# Altium schematic sheet [03] - SCHEMATIC.SchDoc (part 2 of 3)
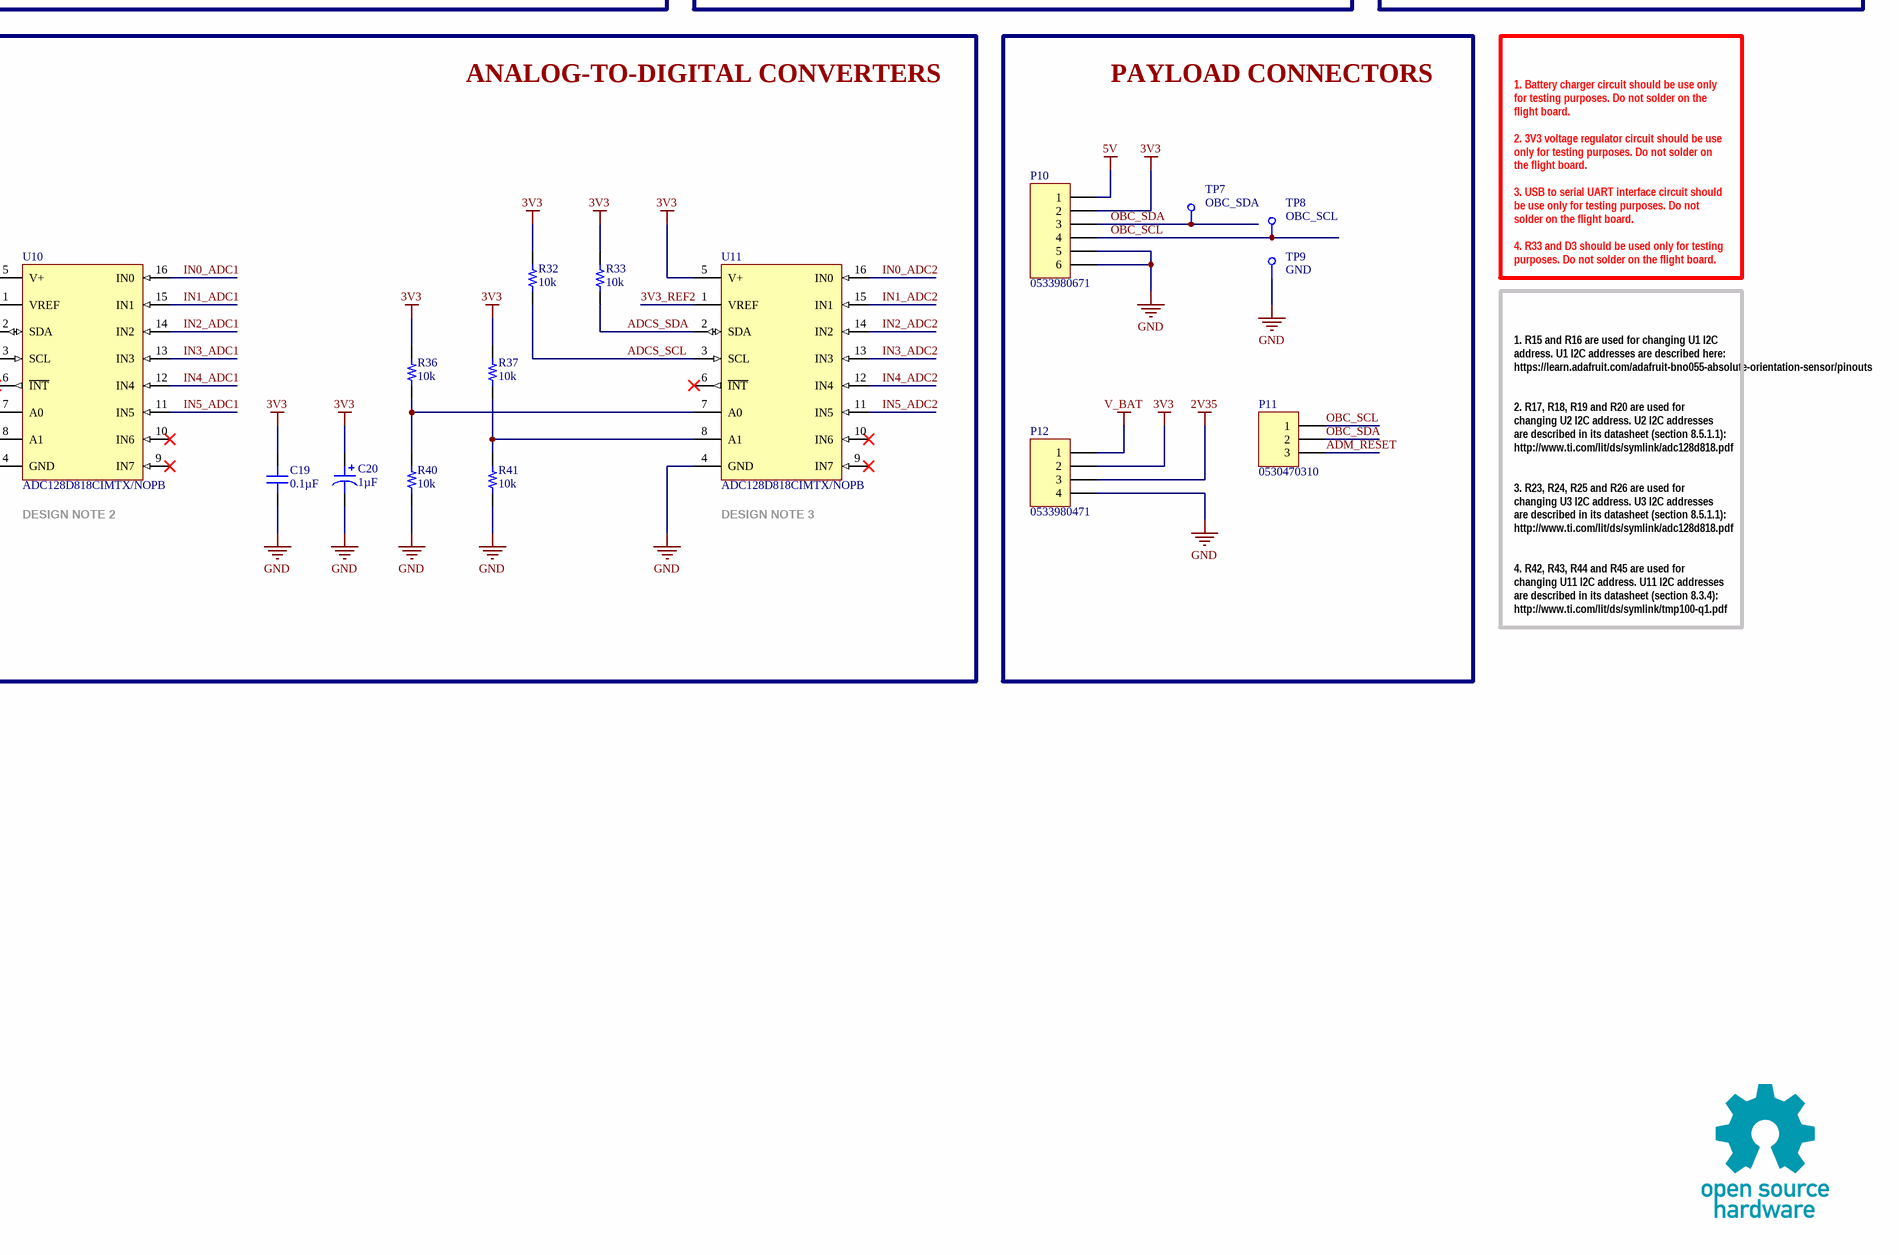
[diagram p4: [03] - SCHEMATIC.SchDoc, bottom right]
## Library data of the parts
C1 C4 = CC0805KKX7R7BB105: CAP CER 1UF 16V X7R 0805; Manufacturer: Yageo; Catalog Drawings: CC_0805_1.25; Featured Product: Yageo - High Capacitance MLCC; Tolerance: ±10%; Online Catalog: CC Series; Other Names: 311-1365-6; Supplier 1: Digi-Key; Manufacturer Part Number: CC0805KKX7R7BB105; Stock 1: 1004673; Pricing 1: 1=0.11, 10=0.079, 100=0.0352, 500=0.0252, 1000=0.0198 (USD); Standard Package: 1; Category: Capacitors; Family: Ceramic Capacitors; Series: CC; Packaging: Digi-Reel®; Voltage - Rated: 16V; Temperature Coefficient: X7R; Mounting Type: Surface Mount, MLCC; Operating Temperature: -55°C ~ 125°C; Applications: General Purpose; Ratings: -; Package / Case: 0805 (2012 Metric); Size / Dimension: 0.079" L x 0.049" W (2.00mm x 1.25mm); Height - Seated (Max): -; Thickness (Max): 0.049" (1.25mm); Lead Spacing: -; Features: -; Lead Style: -; ComponentLink1URL: https://datasheet.ciiva.com/144/mlccorderingcode-144902.pdf; ComponentLink1Description: https://datasheet.ciiva.com/144/mlccorderingcode-144902.pdf; ComponentLink2URL: https://datasheet.ciiva.com/13173/upy-gp-np0-16v-to-50v-8-3714-13173254.pdf; ComponentLink2Description: https://datasheet.ciiva.com/13173/upy-gp-np0-16v-to-50v-8-3714-13173254.pdf; ComponentLink3URL: https://datasheet.ciiva.com/15189/getdatasheetpartid-251802-15189206.pdf; ComponentLink3Description: https://datasheet.ciiva.com/15189/getdatasheetpartid-251802-15189206.pdf; ComponentLink4URL: https://datasheet.ciiva.com/144/mlccorderingcode-144903.pdf; ComponentLink4Description: https://datasheet.ciiva.com/144/mlccorderingcode-144903.pdf; ComponentLink5URL: https://datasheet.ciiva.com/144/mlccorderingcode-144904.pdf; ComponentLink5Description: https://datasheet.ciiva.com/144/mlccorderingcode-144904.pdf; ComponentLink6URL: https://datasheet.ciiva.com/7978/1489800-7978201.pdf; ComponentLink6Description: https://datasheet.ciiva.com/7978/1489800-7978201.pdf; ComponentLink7URL: https://datasheet.ciiva.com/28450/1489800-28450750.pdf; ComponentLink7Description: https://datasheet.ciiva.com/28450/1489800-28450750.pdf; ComponentLink8URL: https://datasheet.ciiva.com/11464/upy-gphc-x7r-6-3v-to-50v-8-11464750.pdf; ComponentLink8Description: https://datasheet.ciiva.com/11464/upy-gphc-x7r-6-3v-to-50v-8-11464750.pdf; Supplier Part Number 1: 311-1365-1-ND
C2 C3 C5 C10 = LMK212BJ106KG-T: CAP CER 10UF 10V X5R 0805; Manufacturer: Taiyo Yuden; PCN Part Number: X5R, X7R Dielectrics 23/Jan/2008; Catalog Drawings: xMK Series_0805_1.25; Featured Product: Multilayer Chip Capacitors; Tolerance: ±10%; Online Catalog: M Series; Kits: 587-1797-KIT-ND  - KIT CAP CER HI CAP 0603 & 0805 S; Other Names: 587-1300-1; Supplier 1: Digi-Key; Manufacturer Part Number: LMK212BJ106KG-T; Stock 1: 858762; Pricing 1: 1=0.14, 10=0.1, 100=0.0468, 500=0.0328, 1000=0.0272 (USD); Standard Package: 1; Category: Capacitors; Family: Ceramic Capacitors; Series: M; Packaging: Cut Tape (CT); Voltage - Rated: 10V; Temperature Coefficient: X5R; Mounting Type: Surface Mount, MLCC; Operating Temperature: -55°C ~ 85°C; Applications: General Purpose; Ratings: -; Package / Case: 0805 (2012 Metric); Size / Dimension: 0.079" L x 0.049" W (2.00mm x 1.25mm); Height - Seated (Max): -; Thickness (Max): 0.053" (1.35mm); Lead Spacing: -; Features: -; Lead Style: -; ComponentLink1URL: https://datasheet.ciiva.com/26872/getdatasheetpartid-638410-26872692.pdf; ComponentLink1Description: https://datasheet.ciiva.com/26872/getdatasheetpartid-638410-26872692.pdf; ComponentLink2URL: https://datasheet.ciiva.com/7975/1497285-7975797.pdf; ComponentLink2Description: https://datasheet.ciiva.com/7975/1497285-7975797.pdf; ComponentLink3URL: https://datasheet.ciiva.com/7975/1497285-7975799.pdf; ComponentLink3Description: https://datasheet.ciiva.com/7975/1497285-7975799.pdf; ComponentLink4URL: https://datasheet.ciiva.com/135/mlcc-all-e-135133.pdf; ComponentLink4Description: https://datasheet.ciiva.com/135/mlcc-all-e-135133.pdf; ComponentLink5URL: https://datasheet.ciiva.com/135/mlcc-all-e-135134.pdf; ComponentLink5Description: https://datasheet.ciiva.com/135/mlcc-all-e-135134.pdf; ComponentLink6URL: https://datasheet.ciiva.com/30259/719lmk212abj106kg-t-30259022.pdf; ComponentLink6Description: https://datasheet.ciiva.com/30259/719lmk212abj106kg-t-30259022.pdf; ComponentLink7URL: https://datasheet.ciiva.com/135/mlcc-all-e-135135.pdf; ComponentLink7Description: https://datasheet.ciiva.com/135/mlcc-all-e-135135.pdf; Supplier Part Number 1: 587-1300-1-ND
C6-C8 = C2012X7R1H104K085AA: CAP CER 0.1UF 50V X7R 0805; Manufacturer: TDK; PCN Part Number: MLCC Part Number Change 30/Nov/2012; Product Training Modules: C Series General Applications SEAT, CCV, and TVCL Design Tools Guide to Replacing an Electrolytic Capacitor with an MLCC; Tolerance: ±10%; Online Catalog: C Series, General Purpose; Kits: 445-9015-KIT-ND  - KIT MLCC 1000PF-47UF 0805 10-50V; Other Names: 445-7534-1; Supplier 1: Digi-Key; Manufacturer Part Number: C2012X7R1H104K085AA; Stock 1: 6397; Pricing 1: 1=0.12, 10=0.086, 100=0.0403, 500=0.0282, 1000=0.0234 (USD); RoHS Information: RoHS Certificate-MLCC; Standard Package: 1; Category: Capacitors; Family: Ceramic Capacitors; Series: C; Packaging: Cut Tape (CT); Voltage - Rated: 50V; Temperature Coefficient: X7R; Mounting Type: Surface Mount, MLCC; Operating Temperature: -55°C ~ 125°C; Applications: General Purpose; Ratings: -; Package / Case: 0805 (2012 Metric); Size / Dimension: 0.079" L x 0.049" W (2.00mm x 1.25mm); Height - Seated (Max): -; Thickness (Max): 0.037" (0.95mm); Lead Spacing: -; Features: -; Lead Style: -; ComponentLink1URL: https://datasheet.ciiva.com/11788/0900766b80c1bb00-11788128.pdf; ComponentLink1Description: https://datasheet.ciiva.com/11788/0900766b80c1bb00-11788128.pdf; ComponentLink2URL: https://datasheet.ciiva.com/6250/tdkmlcccaprange-6250821.pdf; ComponentLink2Description: https://datasheet.ciiva.com/6250/tdkmlcccaprange-6250821.pdf; ComponentLink3URL: https://datasheet.ciiva.com/24217/c2012x7r1h104k085aa-264864-24217862.pdf; ComponentLink3Description: https://datasheet.ciiva.com/24217/c2012x7r1h104k085aa-264864-24217862.pdf; ComponentLink4URL: https://datasheet.ciiva.com/24191/e412-c-24191447.pdf; ComponentLink4Description: https://datasheet.ciiva.com/24191/e412-c-24191447.pdf; ComponentLink5URL: https://datasheet.ciiva.com/6250/tdkmlcccaprange-6250824.pdf; ComponentLink5Description: https://datasheet.ciiva.com/6250/tdkmlcccaprange-6250824.pdf; ComponentLink6URL: https://datasheet.ciiva.com/23803/1796654-23803035.pdf; ComponentLink6Description: https://datasheet.ciiva.com/23803/1796654-23803035.pdf; ComponentLink7URL: https://datasheet.ciiva.com/28602/1571323-28602204.pdf; ComponentLink7Description: https://datasheet.ciiva.com/28602/1571323-28602204.pdf; Supplier Part Number 1: 445-7534-1-ND
C9 C14 C16 C17 C19 = C0805C104Z3VACTU: Multilayer Ceramic Capacitors MLCC - SMD/SMT 25volts 0.1uF Y5V -20+80%; Manufacturer: KEMET; Part # Aliases: C0805C104Z3VAC7800; Capacitance - nF: 100 nF; Capacitance - pF: 100000 pF; Voltage Rating: 25 V; Tolerance: - 20 %, + 80 %; Case Height: 0.9 mm; Case Length: 2 mm; Case Width: 1.2 mm; Class: 3; Dissipation Factor DF: 7; Temperature Coefficient / Code: - 82 %, + 22 %; Type: Y5V Dielectric, Commercial; Supplier 1: Digi-Key; Manufacturer Part Number: C0805C104Z3VACTU; Stock 1: 70310; Pricing 1: 1=0.1, 10=0.065, 100=0.0289, 500=0.0207, 1000=0.0162 (USD); Dimensions: 1.2 mm W x 2 mm L x 0.9 mm H; Product Category: Multilayer Ceramic Capacitors MLCC - SMD/SMT; RoHS: Details; Brand: Kemet; Voltage Rating DC: 25 V; Dielectric: Y5V; Case Code - in: 0805; Case Code - mm: 2012; Minimum Operating Temperature: - 30 C; Maximum Operating Temperature: + 85 C; Product: General Type MLCCs; Lead Spacing: 0.75 mm; Operating Temperature Range: - 30 C to + 85 C; Package / Case: 0805 (2012 metric); Packaging: Reel; Series: C0805C; Factory Pack Quantity: 4000; Termination Style: SMD/SMT; ComponentLink1URL: http://www.farnell.com/datasheets/2112180.pdf; ComponentLink1Description: http://www.farnell.com/datasheets/2112180.pdf; ComponentLink2URL: http://www.mouser.com/ds/2/212/KEM_C1005_Y5V_SMD-1101305.pdf; ComponentLink2Description: http://www.mouser.com/ds/2/212/KEM_C1005_Y5V_SMD-1101305.pdf; ComponentLink3URL: https://search.kemet.com/component-edge/download/datasheet/C0805C104Z3VACTU.pdf; ComponentLink3Description: https://search.kemet.com/component-edge/download/datasheet/C0805C104Z3VACTU.pdf; ComponentLink4URL: http://capacitoredge.kemet.com/capedge2/DataSheet?pn=C0805C104Z3VACTU; ComponentLink4Description: http://capacitoredge.kemet.com/capedge2/DataSheet?pn=C0805C104Z3VACTU; ComponentLink5URL: http://components.arrow.com/part/dataview/2091117S3443012N7429; ComponentLink5Description: http://components.arrow.com/part/dataview/2091117S3443012N7429; Supplier Part Number 1: 399-9158-1-ND
C11 C12 = GCM155R71H223KA55D: CAP CER 0.022UF 50V X7R 0402; Manufacturer: Murata; Tolerance (%): ±10 %; Supplier 1: Digi-Key; Manufacturer Part Number: GCM155R71H223KA55D; Stock 1: 1313391; Pricing 1: 1=0.1, 10=0.042, 100=0.0186, 500=0.0133, 1000=0.0104, 2500=0.0095, 5000=0.0087 (USD); Dielectric: X7R; Rated Voltage: 50 V; Case Size: 0402 (1005 Metric); ComponentLink1URL: https://datasheet.ciiva.com/155/product-155890.pdf; ComponentLink1Description: https://datasheet.ciiva.com/155/product-155890.pdf; ComponentLink2URL: https://datasheet.ciiva.com/155/product-155891.pdf; ComponentLink2Description: https://datasheet.ciiva.com/155/product-155891.pdf; ComponentLink3URL: https://datasheet.ciiva.com/155/product-155892.pdf; ComponentLink3Description: https://datasheet.ciiva.com/155/product-155892.pdf; ComponentLink4URL: https://datasheet.ciiva.com/16199/product-16199333.pdf; ComponentLink4Description: https://datasheet.ciiva.com/16199/product-16199333.pdf; ComponentLink5URL: https://datasheet.ciiva.com/16624/product-16624552.pdf; ComponentLink5Description: https://datasheet.ciiva.com/16624/product-16624552.pdf; Supplier Part Number 1: 490-4763-1-ND
C13 C15 = C0805C180J5GAC-TU: CAP CER 18PF 50V NP0 0805; Manufacturer: KEMET; Case Style: Ceramic Chip; Product Depth (mm): 1.25 mm; Product Diameter (mm): Not Required mm; Product Height (mm): 0.78 mm; Product Length (mm): 2 mm; Rad Hardened: No; Temp Coeff (Dielectric): C0G; Tolerance (+ or -): 5%; Voltage: 50VDC; Wire Form: Not Required; Supplier 1: Digi-Key; Manufacturer Part Number: C0805C180J5GAC-TU; Stock 1: 86172; Pricing 1: 1=0.11, 10=0.08, 100=0.0374, 500=0.0262, 1000=0.0217 (USD); Construction: SMT Chip; Failure Rate: Not Required; Mounting Style: Surface Mount; Operating Temp Range: -55C to 125C; Package / Case: 0805; Packaging: Tape and Reel; ComponentLink1URL: https://datasheet.ciiva.com/6136/1725432-6136736.pdf; ComponentLink1Description: https://datasheet.ciiva.com/6136/1725432-6136736.pdf; ComponentLink2URL: https://datasheet.ciiva.com/144/docfinderpartnumber-c0805c180j5gactu-144929.pdf; ComponentLink2Description: https://datasheet.ciiva.com/144/docfinderpartnumber-c0805c180j5gactu-144929.pdf; ComponentLink3URL: https://datasheet.ciiva.com/22746/1769375-22746770.pdf; ComponentLink3Description: https://datasheet.ciiva.com/22746/1769375-22746770.pdf; ComponentLink4URL: https://datasheet.ciiva.com/28696/1789732-28696024.pdf; ComponentLink4Description: https://datasheet.ciiva.com/28696/1789732-28696024.pdf; ComponentLink5URL: https://datasheet.ciiva.com/7842/1725432-7842235.pdf; ComponentLink5Description: https://datasheet.ciiva.com/7842/1725432-7842235.pdf; ComponentLink6URL: https://datasheet.ciiva.com/11463/kem-c1003-c0g-smd-11463499.pdf; ComponentLink6Description: https://datasheet.ciiva.com/11463/kem-c1003-c0g-smd-11463499.pdf; ComponentLink7URL: https://datasheet.ciiva.com/7842/1725432-7842236.pdf; ComponentLink7Description: https://datasheet.ciiva.com/7842/1725432-7842236.pdf; ComponentLink8URL: https://datasheet.ciiva.com/26923/getdatasheetpartid-759702-26923980.pdf; ComponentLink8Description: https://datasheet.ciiva.com/26923/getdatasheetpartid-759702-26923980.pdf; ComponentLink9URL: https://datasheet.ciiva.com/5419/kem-c1003-c0g-smd-356956-5419246.pdf; ComponentLink9Description: https://datasheet.ciiva.com/5419/kem-c1003-c0g-smd-356956-5419246.pdf; Supplier Part Number 1: 399-1112-1-ND
C18 C20 = F921C105MPA: CAP TANT 1UF 16V 20% 0805; Manufacturer: Kyocera AVX; Supplier 1: Digi-Key; Manufacturer Part Number: F921C105MPA; Stock 1: 35413; Pricing 1: 1=0.39, 10=0.274, 100=0.1641, 500=0.1231, 1000=0.1039 (USD); ComponentLink1URL: http://www.mouser.com/ds/2/40/f92-776551.pdf; ComponentLink1Description: http://www.mouser.com/ds/2/40/f92-776551.pdf; ComponentLink2URL: http://datasheets.avx.com/f92.pdf; ComponentLink2Description: http://datasheets.avx.com/f92.pdf; Supplier Part Number 1: 478-8126-6-ND
D1 D3 D5 = APT1608SYCK: LED 1.6X0.8MM 590NM YLW CLR SMD; Manufacturer: Kingbright; Catalog Drawings: APT1608 Series Top / APT1608 Series Side; 3D Model: APT1608x.sldprt / APT1608x.pro / APT1608x.igs / APT1608x.stp; Color: Yellow; Millicandela Rating: 150mcd; Voltage - Forward (Vf) (Typ): 2V; Current - Test: 20mA; Viewing Angle: 120°; Lens Type: Clear; Lens Style/Size: Rectangle with Flat Top, 1.2mm x 0.8mm; Online Catalog: 0603 Rectangle with Flat Top Chip LEDs; Other Names: 754-1124-2; Supplier 1: Digi-Key; Manufacturer Part Number: APT1608SYCK; Stock 1: 241560; Pricing 1: 1=0.43, 10=0.307, 25=0.2352, 100=0.1535, 250=0.1125, 500=0.0955, 1000=0.0784 (USD); Standard Package: 2,000; Category: Optoelectronics; Family: LED Indication - Discrete; Packaging: Tape & Reel (TR); Wavelength - Dominant: 590nm; Wavelength - Peak: 590nm; Package / Case: 0603 (1608 Metric); Size / Dimension: 1.60mm L x 0.80mm W; Height: 0.75mm; Mounting Type: Surface Mount; ComponentLink1URL: https://datasheet.ciiva.com/2113/apt1608syck-2113824.pdf; ComponentLink1Description: https://datasheet.ciiva.com/2113/apt1608syck-2113824.pdf; ComponentLink2URL: https://datasheet.ciiva.com/2113/apt1608syck-2113825.pdf; ComponentLink2Description: https://datasheet.ciiva.com/2113/apt1608syck-2113825.pdf; ComponentLink3URL: https://datasheet.ciiva.com/2113/apt1608syck-2113826.pdf; ComponentLink3Description: https://datasheet.ciiva.com/2113/apt1608syck-2113826.pdf; ComponentLink4URL: https://datasheet.ciiva.com/4688/apt1608syck-35136-4688900.pdf; ComponentLink4Description: https://datasheet.ciiva.com/4688/apt1608syck-35136-4688900.pdf; ComponentLink5URL: https://datasheet.ciiva.com/14603/70062842-14603786.pdf; ComponentLink5Description: https://datasheet.ciiva.com/14603/70062842-14603786.pdf; Supplier Part Number 1: 754-1124-1-ND
D2 = MBR120VLSFT3G: Schottky Diodes & Rectifiers 1A 20V; Manufacturer: ON Semiconductor; PCN Design/Specification: SOD123-FL Package Height 13/Sep/2013; Voltage - Forward (Vf) (Max) @ If: 340mV @ 1A; Speed: Fast Recovery =  200mA (Io); Current - Reverse Leakage @ Vr: 600µA @ 20V; Other Names: MBR120VLSFT3GOSDKR; Supplier 1: Digi-Key; Manufacturer Part Number: MBR120VLSFT3G; Stock 1: 5944; Pricing 1: 1=0.42, 10=0.338, 100=0.2298, 500=0.1723, 1000=0.1293 (USD); Standard Package: 1; Category: Discrete Semiconductor Products; Family: Diodes, Rectifiers - Single; Series: -; Packaging: Digi-Reel®; Diode Type: Schottky; Voltage - DC Reverse (Vr) (Max): 20V; Current - Average Rectified (Io): 1A; Reverse Recovery Time (trr): -; Capacitance @ Vr, F: -; Mounting Type: Surface Mount; Package / Case: SOD-123F; Supplier Device Package: SOD-123FL; Operating Temperature - Junction: -65°C ~ 125°C; Online Catalog: Schottky Diode; ComponentLink1URL: https://datasheet.ciiva.com/4715/mbr120vlsft1-d-107081-4715104.pdf; ComponentLink1Description: https://datasheet.ciiva.com/4715/mbr120vlsft1-d-107081-4715104.pdf; ComponentLink2URL: https://datasheet.ciiva.com/6380/mbr120vlsft1-d-6380907.pdf; ComponentLink2Description: https://datasheet.ciiva.com/6380/mbr120vlsft1-d-6380907.pdf; ComponentLink3URL: https://datasheet.ciiva.com/8294/mbr120vlsft1-d-8294603.pdf; ComponentLink3Description: https://datasheet.ciiva.com/8294/mbr120vlsft1-d-8294603.pdf; ComponentLink4URL: https://datasheet.ciiva.com/6380/mbr120vlsft1-d-6380910.pdf; ComponentLink4Description: https://datasheet.ciiva.com/6380/mbr120vlsft1-d-6380910.pdf; Supplier Part Number 1: MBR120VLSFT3GOSCT-ND
D4 = APT1608SGC: LED 1.6X0.8MM 568NM GRN CLR SMD; Manufacturer: Kingbright; Catalog Drawings: APT1608 Series Top / APT1608 Series Side; 3D Model: APT1608x.sldprt / APT1608x.pro / APT1608x.igs / APT1608x.stp; Color: Green; Wavelength - Peak: 565nm; Millicandela Rating: 15mcd; Voltage - Forward (Vf) (Typ): 2.2V; Current - Test: 20mA; Viewing Angle: 120°; Lens Type: Clear; Lens Style/Size: Rectangle with Flat Top, 1.2mm x 0.8mm; Online Catalog: 0603 Rectangle with Flat Top Chip LEDs; Other Names: 754-1121-2; Supplier 1: Digi-Key; Manufacturer Part Number: APT1608SGC; Stock 1: 466268; Pricing 1: 1=0.39, 10=0.282, 25=0.208, 100=0.1485, 250=0.101, 500=0.0891, 1000=0.0698 (USD); Standard Package: 2,000; Category: Optoelectronics; Family: LED Indication - Discrete; Packaging: Tape & Reel (TR); Wavelength - Dominant: 568nm; Package / Case: 0603 (1608 Metric); Size / Dimension: 1.60mm L x 0.80mm W; Height: 0.75mm; Mounting Type: Surface Mount; ComponentLink1URL: https://datasheet.ciiva.com/2113/apt1608sgc-2113808.pdf; ComponentLink1Description: https://datasheet.ciiva.com/2113/apt1608sgc-2113808.pdf; ComponentLink2URL: https://datasheet.ciiva.com/12400/apt1608sgc-32861-12400932.pdf; ComponentLink2Description: https://datasheet.ciiva.com/12400/apt1608sgc-32861-12400932.pdf; ComponentLink3URL: https://datasheet.ciiva.com/14603/70062839-14603927.pdf; ComponentLink3Description: https://datasheet.ciiva.com/14603/70062839-14603927.pdf; Supplier Part Number 1: 754-1121-1-ND; Supplier 2: Digi-Key; Supplier Part Number 2: 311-10.0MCRCT-ND
MH1-MH4 = MH_3.8MMNC_2MMD: Mounting Hole 3.8mm Diameter (Non Copper), 2.5mm Drill NPTH
P1 = S2B-PH-SM4-TB(LF)(SN): 2 Positions Header, Shrouded Connector 0.079" (2.00mm) Surface Mount, Right Angle Tin; Manufacturer: JST; No of Positions: 2; Pitch: 2 mm; Style/Orientation: Right Angle Header/Plug; Supplier 1: Digi-Key; Manufacturer Part Number: S2B-PH-SM4-TB(LF)(SN); Stock 1: 113530; Pricing 1: 1=0.58, 10=0.547, 100=0.4194, 500=0.3647 (USD); Type: Shrouded Header; Termination: Crimp; ComponentLink1URL: https://datasheet.ciiva.com/11747/0900766b80df0d9d-11747104.pdf; ComponentLink1Description: https://datasheet.ciiva.com/11747/0900766b80df0d9d-11747104.pdf; ComponentLink2URL: https://datasheet.ciiva.com/712/eph-712514.pdf; ComponentLink2Description: https://datasheet.ciiva.com/712/eph-712514.pdf; ComponentLink3URL: https://datasheet.ciiva.com/712/eph-712515.pdf; ComponentLink3Description: https://datasheet.ciiva.com/712/eph-712515.pdf; ComponentLink4URL: https://datasheet.ciiva.com/712/eph-712516.pdf; ComponentLink4Description: https://datasheet.ciiva.com/712/eph-712516.pdf; ComponentLink5URL: https://datasheet.ciiva.com/16199/s2b-ph-sm4-tblfsn-16199686.pdf; ComponentLink5Description: https://datasheet.ciiva.com/16199/s2b-ph-sm4-tblfsn-16199686.pdf; ComponentLink6URL: https://datasheet.ciiva.com/26894/getdatasheetpartid-406256-26894907.pdf; ComponentLink6Description: https://datasheet.ciiva.com/26894/getdatasheetpartid-406256-26894907.pdf; Supplier Part Number 1: 455-1749-1-ND
P2 = 67997-106HLF: 6 Positions Header, Unshrouded Connector 0.100" (2.54mm) Through Hole Gold or Gold, GXT™; Manufacturer: Amphenol FCI; No. of Rows: 2; No. of Contacts: 6; Contact Termination: Through Hole Vertical; Supplier 1: Digi-Key; Manufacturer Part Number: 67997-106HLF; Stock 1: 896; Pricing 1: 1=1.73, 10=1.568, 100=1.3436, 500=1.1197, 1000=0.9597, 5000=0.8509, 10000=0.8317 (USD); Series: 67997; Pitch Spacing: 2.54mm; Gender: Header; Contact Plating: Gold; Contact Material: Phosphor Bronze; ComponentLink1URL: https://datasheet.ciiva.com/10149/67996-10149221.pdf; ComponentLink1Description: https://datasheet.ciiva.com/10149/67996-10149221.pdf; ComponentLink2URL: https://datasheet.ciiva.com/46393/1876884-46393067.pdf; ComponentLink2Description: https://datasheet.ciiva.com/46393/1876884-46393067.pdf; ComponentLink3URL: https://datasheet.ciiva.com/722/67996-722044.pdf; ComponentLink3Description: https://datasheet.ciiva.com/722/67996-722044.pdf; ComponentLink4URL: https://datasheet.ciiva.com/5153/67996-222463-5153820.pdf; ComponentLink4Description: https://datasheet.ciiva.com/5153/67996-222463-5153820.pdf; ComponentLink5URL: https://datasheet.ciiva.com/16726/67996-16726286.pdf; ComponentLink5Description: https://datasheet.ciiva.com/16726/67996-16726286.pdf; Supplier Part Number 1: 609-3393-ND
P3 = 10033526-N3212LF: Conn Mini USB Type B RCP 5 POS 0.8mm Solder RA SMD 5 Terminal 1 Port T/R; Manufacturer: Amphenol FCI; Brand: FCI; Number of Contacts: 5 Contact; Number of Ports: 1 Port; Gender: Female; Connector Type: Mini USB Type B Receptacle; Insulation Resistance: 100 MOhms; Mounting Angle: Right; Supplier 1: Digi-Key; Manufacturer Part Number: 10033526-N3212LF; Stock 1: 10314; Pricing 1: 1=0.71, 10=0.669, 25=0.602, 50=0.5352, 100=0.5128, 250=0.4682 (USD); Product Category: USB Connectors; RoHS: Details; Product: Mini USB Type B Connectors; Standard: USB; Termination Style: Solder Pad; Color: Black; Contact Material: Copper Alloy; Contact Plating: Gold; Flammability Rating: UL 94 V-0; Packaging: Reel; Shell Plating: Nickel; Factory Pack Quantity: 750; ComponentLink1URL: https://datasheet.ciiva.com/15181/getdatasheetpartid-168038-15181221.pdf; ComponentLink1Description: https://datasheet.ciiva.com/15181/getdatasheetpartid-168038-15181221.pdf; ComponentLink2URL: https://datasheet.ciiva.com/29660/10033526-29660229.pdf; ComponentLink2Description: https://datasheet.ciiva.com/29660/10033526-29660229.pdf; ComponentLink3URL: https://datasheet.ciiva.com/29660/10033526-29660230.pdf; ComponentLink3Description: https://datasheet.ciiva.com/29660/10033526-29660230.pdf; ComponentLink4URL: https://datasheet.ciiva.com/3094/10033526-3094696.pdf; ComponentLink4Description: https://datasheet.ciiva.com/3094/10033526-3094696.pdf; ComponentLink5URL: https://datasheet.ciiva.com/16668/10033526-16668584.pdf; ComponentLink5Description: https://datasheet.ciiva.com/16668/10033526-16668584.pdf; ComponentLink6URL: https://datasheet.ciiva.com/3094/10033526-3094413.pdf; ComponentLink6Description: https://datasheet.ciiva.com/3094/10033526-3094413.pdf; Supplier Part Number 1: 609-4700-1-ND
P4-P6 = 61300211121: Headers & Wire Housings WR-PHD 2.54mm Header 2P THT; Manufacturer: Wurth Electronics; Current Rating: 3A; Voltage Rating: 250V; Number of Positions: 2; Gender: Male; Connector Type: Male Pin; Pitch: 0.1inch; Supplier 1: Digi-Key; Manufacturer Part Number: 61300211121; Stock 1: 98753; Pricing 1: 1=0.13, 10=0.106, 25=0.088, 50=0.074, 100=0.067, 1000=0.061 (USD); Mount: Through Hole; Contact Plating: Gold; Housing Material: PBT; Contact Material: Copper,Copper Alloy; Colour: Black; Min Operating Temperature: -40°C; Max Operating Temperature: 125°C; Number of Rows: 1; Contact Gender: Male; Packaging: Bulk; Termination: Through Hole; Number of Contacts: 2; Contact Mating Length: 0.236inch; REACH SVHC: Unknown; Lead Free: Lead Free; ComponentLink1URL: https://datasheet.ciiva.com/13619/6130xx11121-48870-13619345.pdf; ComponentLink1Description: https://datasheet.ciiva.com/13619/6130xx11121-48870-13619345.pdf; Supplier Part Number 1: 732-5315-ND
P7-P9 P13 = 0532610371: 3 Positions Header, Shrouded Connector 0.049" (1.25mm) Surface Mount, Right Angle Tin; Manufacturer: Molex; Number of Positions: 3; Number of Positions Loaded: All; Supplier 1: Digi-Key; Manufacturer Part Number: 0532610371; Stock 1: 28698; Pricing 1: 1=1.13, 10=0.995, 100=0.8586, 500=0.7025 (USD); Category: Connectors, Interconnects; Family: Rectangular Connectors - Headers, Male Pins; Series: PicoBlade™ 53261; Packaging: Cut Tape (CT); Contact Type: Blade Pin; Connector Type: Header, Shrouded; Pitch: 0.049" (1.25mm); Number of Rows: 1; Row Spacing: -; Contact Mating Length: -; Mounting Type: Surface Mount, Right Angle; Termination: Solder; Fastening Type: -; Features: Solder Retention; Contact Finish: Tin; Contact Finish Thickness: 39µin (1.00µm); Color: Natural; ComponentLink1URL: https://datasheet.ciiva.com/392/532610371-sd-392113.pdf; ComponentLink1Description: https://datasheet.ciiva.com/392/532610371-sd-392113.pdf; ComponentLink2URL: https://datasheet.ciiva.com/392/532610371-sd-392114.pdf; ComponentLink2Description: https://datasheet.ciiva.com/392/532610371-sd-392114.pdf; ComponentLink3URL: https://datasheet.ciiva.com/392/532610371-sd-392115.pdf; ComponentLink3Description: https://datasheet.ciiva.com/392/532610371-sd-392115.pdf; ComponentLink4URL: https://datasheet.ciiva.com/3117/0532610371-pcb-headers-3117604.pdf; ComponentLink4Description: https://datasheet.ciiva.com/3117/0532610371-pcb-headers-3117604.pdf; ComponentLink5URL: https://datasheet.ciiva.com/3117/0532610371-pcb-headers-3117605.pdf; ComponentLink5Description: https://datasheet.ciiva.com/3117/0532610371-pcb-headers-3117605.pdf; ComponentLink6URL: https://datasheet.ciiva.com/3932/333250532610371-pcb-headers-3932824.pdf; ComponentLink6Description: https://datasheet.ciiva.com/3932/333250532610371-pcb-headers-3932824.pdf; ComponentLink7URL: https://datasheet.ciiva.com/48768/0532610371-pcb-headers-48768286.pdf; ComponentLink7Description: https://datasheet.ciiva.com/48768/0532610371-pcb-headers-48768286.pdf; Supplier Part Number 1: WM7621CT-ND
P10 = 0533980671: 6 Positions Header, Shrouded Connector 0.049" (1.25mm) Surface Mount, Right Angle Tin; Manufacturer: Molex; Manufacturer Part Number: 53398-0671; Voltage Rating: 125V; Current Rating: 1A; Number of Positions: 6; Gender: Male; Contact Resistance: 20mR; Insulation Resistance: 100MR; Glow Wire Compliant: Non-compliant; Supplier 1: Digi-Key; Stock 1: 40236; Pricing 1: 1=1.42, 10=1.249, 100=1.0776, 500=0.8817 (USD); Mount: Surface Mount; Colour: Natural; Housing Colour: Natural; Housing Material: Nylon; Contact Plating: Tin; Contact Material: Bronze,Tin; Body Plating: Tin; Min Operating Temperature: -40°C; Max Operating Temperature: 85°C; Packaging: Tape and Reel; Termination: Solder; Number of Rows: 1; Package Quantity: 1000; Orientation: Vertical; Number of Contacts: 6; Voltage Rating (AC): 125V; Working Voltage: 125V; Number of Circuits: 6; Voltage Rating (DC): 125V; Pitch: 1.25mm; Lead Pitch: 1.25mm; Radiation Hardening: No; REACH SVHC: Unknown; Lead Free: Lead Free; Flammability Rating: UL94 V-0; ComponentLink1URL: https://datasheet.ciiva.com/16658/0533980671-pcb-headers-16658433.pdf; ComponentLink1Description: https://datasheet.ciiva.com/16658/0533980671-pcb-headers-16658433.pdf; ComponentLink2URL: https://datasheet.ciiva.com/34303/1932643-34303345.pdf; ComponentLink2Description: https://datasheet.ciiva.com/34303/1932643-34303345.pdf; ComponentLink3URL: https://datasheet.ciiva.com/5153/0533980671-pcb-headers-256970-5153159.pdf; ComponentLink3Description: https://datasheet.ciiva.com/5153/0533980671-pcb-headers-256970-5153159.pdf; ComponentLink4URL: https://datasheet.ciiva.com/14156/gf116833-116846-e-14156247.pdf; ComponentLink4Description: https://datasheet.ciiva.com/14156/gf116833-116846-e-14156247.pdf; ComponentLink5URL: https://datasheet.ciiva.com/46393/1849224-46393479.pdf; ComponentLink5Description: https://datasheet.ciiva.com/46393/1849224-46393479.pdf; ComponentLink6URL: https://datasheet.ciiva.com/7917/1849224-7917050.pdf; ComponentLink6Description: https://datasheet.ciiva.com/7917/1849224-7917050.pdf; ComponentLink7URL: https://datasheet.ciiva.com/7917/1849224-7917051.pdf; ComponentLink7Description: https://datasheet.ciiva.com/7917/1849224-7917051.pdf; ComponentLink8URL: https://datasheet.ciiva.com/18454/70090674-18454268.pdf; ComponentLink8Description: https://datasheet.ciiva.com/18454/70090674-18454268.pdf; ComponentLink9URL: https://datasheet.ciiva.com/11747/0900766b8078fc9e-11747389.pdf; ComponentLink9Description: https://datasheet.ciiva.com/11747/0900766b8078fc9e-11747389.pdf; ComponentLink10URL: https://datasheet.ciiva.com/22683/1632143-22683422.pdf; ComponentLink10Description: https://datasheet.ciiva.com/22683/1632143-22683422.pdf; Supplier Part Number 1: WM7610DKR-ND
P11 = 0530470310: CONN HEADER 3POS 1.25MM VERT TIN; Manufacturer: Molex; Connector Type: Header, Shrouded; Number of Positions: 3; Number of Positions Loaded: All; Pitch: 0.049" (1.25mm); Supplier 1: Digi-Key; Manufacturer Part Number: 0530470310; Stock 1: 22343; Pricing 1: 1=0.42, 10=0.393, 100=0.2751, 500=0.2358, 1000=0.1965, 5000=0.1685, 10000=0.1572 (USD); Category: Connectors, Interconnects; Family: Rectangular Connectors - Headers, Male Pins; Series: PicoBlade™ 53047; Packaging: Tray; Contact Type: Blade Pin; Number of Rows: 1; Row Spacing: -; Contact Mating Length: 0.089" (2.25mm); Mounting Type: Through Hole; Termination: Solder; Fastening Type: -; Features: -; Contact Finish: Tin; Contact Finish Thickness: 35µin (0.90µm); Color: Natural; ComponentLink1URL: https://datasheet.ciiva.com/6813/530470310-sd-6813731.pdf; ComponentLink1Description: https://datasheet.ciiva.com/6813/530470310-sd-6813731.pdf; ComponentLink2URL: https://datasheet.ciiva.com/3935/92660530470310-pcb-headers-3935129.pdf; ComponentLink2Description: https://datasheet.ciiva.com/3935/92660530470310-pcb-headers-3935129.pdf; ComponentLink3URL: https://datasheet.ciiva.com/3117/0530470310-pcb-headers-3117581.pdf; ComponentLink3Description: https://datasheet.ciiva.com/3117/0530470310-pcb-headers-3117581.pdf; Supplier Part Number 1: WM1732-ND
P12 = 0533980471: 4 Positions Header, Shrouded Connector 0.049" (1.25mm) Surface Mount, Right Angle Tin; Manufacturer: Molex; Manufacturer Part Number: 53398-0471; Gender: Male; Current Rating: 1A; Voltage Rating: 125V; Number of Positions: 4; Contact Resistance: 20mR; Insulation Resistance: 100MR; Glow Wire Compliant: Non-compliant; Supplier 1: Digi-Key; Stock 1: 49208; Pricing 1: 1=1.19, 10=1.044, 100=0.901, 500=0.73716 (USD); Mount: Surface Mount; Colour: Natural; Housing Colour: Natural; Housing Material: Nylon; Contact Plating: Tin; Contact Material: Bronze,Brass,Tin; Body Plating: Tin; Min Operating Temperature: -40°C; Max Operating Temperature: 85°C; Packaging: Tape and Reel; Termination: Solder; Number of Rows: 1; Package Quantity: 1000; Number of Contacts: 4; Orientation: Vertical; Voltage Rating (AC): 125V; Working Voltage: 125V; Number of Circuits: 4; Voltage Rating (DC): 125V; Pitch: 1.25mm; Lead Pitch: 1.25mm; Radiation Hardening: No; REACH SVHC: Unknown; Lead Free: Lead Free; Flammability Rating: UL94 V-0; ComponentLink1URL: https://datasheet.ciiva.com/5154/0533980471-pcb-headers-171069-5154864.pdf; ComponentLink1Description: https://datasheet.ciiva.com/5154/0533980471-pcb-headers-171069-5154864.pdf; ComponentLink2URL: https://datasheet.ciiva.com/39121/1932627-39121616.pdf; ComponentLink2Description: https://datasheet.ciiva.com/39121/1932627-39121616.pdf; ComponentLink3URL: https://datasheet.ciiva.com/23964/0533980471-pcb-headers-23964130.pdf; ComponentLink3Description: https://datasheet.ciiva.com/23964/0533980471-pcb-headers-23964130.pdf; ComponentLink4URL: https://datasheet.ciiva.com/14156/gf116833-116846-e-14156245.pdf; ComponentLink4Description: https://datasheet.ciiva.com/14156/gf116833-116846-e-14156245.pdf; ComponentLink5URL: https://datasheet.ciiva.com/28592/0533980471-pcb-headers-28592022.pdf; ComponentLink5Description: https://datasheet.ciiva.com/28592/0533980471-pcb-headers-28592022.pdf; ComponentLink6URL: https://datasheet.ciiva.com/22700/1841151-22700615.pdf; ComponentLink6Description: https://datasheet.ciiva.com/22700/1841151-22700615.pdf; ComponentLink7URL: https://datasheet.ciiva.com/30178/225160533980471-pcb-headers-30178167.pdf; ComponentLink7Description: https://datasheet.ciiva.com/30178/225160533980471-pcb-headers-30178167.pdf; ComponentLink8URL: https://datasheet.ciiva.com/11748/0900766b80ab946a-11748472.pdf; ComponentLink8Description: https://datasheet.ciiva.com/11748/0900766b80ab946a-11748472.pdf; ComponentLink9URL: https://datasheet.ciiva.com/31408/0533980471-pcb-headers-31408393.pdf; ComponentLink9Description: https://datasheet.ciiva.com/31408/0533980471-pcb-headers-31408393.pdf; ComponentLink10URL: https://datasheet.ciiva.com/46384/1788582-46384012.pdf; ComponentLink10Description: https://datasheet.ciiva.com/46384/1788582-46384012.pdf; ComponentLink11URL: https://datasheet.ciiva.com/9468/0533980471-pcb-headers-9468286.pdf; ComponentLink11Description: https://datasheet.ciiva.com/9468/0533980471-pcb-headers-9468286.pdf; ComponentLink12URL: https://datasheet.ciiva.com/16658/0533980471-pcb-headers-16658431.pdf; ComponentLink12Description: https://datasheet.ciiva.com/16658/0533980471-pcb-headers-16658431.pdf; Supplier Part Number 1: WM7608CT-ND
P14 P15 = 0530470310: Conn Wire to Board HDR 3 POS 1.25mm Solder ST Thru-Hole PicoBlade™ Tray; Manufacturer: Molex; Connector Type: Header, Shrouded; Number of Positions: 3; Number of Positions Loaded: All; Pitch: 0.049" (1.25mm); Supplier 1: Digi-Key; Manufacturer Part Number: 0530470310; Stock 1: 22343; Pricing 1: 1=0.42, 10=0.393, 100=0.2751, 500=0.2358, 1000=0.1965, 5000=0.1685, 10000=0.1572 (USD); Category: Connectors, Interconnects; Family: Rectangular Connectors - Headers, Male Pins; Series: PicoBlade™ 53047; Packaging: Tray; Contact Type: Blade Pin; Number of Rows: 1; Row Spacing: -; Contact Mating Length: 0.089" (2.25mm); Mounting Type: Through Hole; Termination: Solder; Fastening Type: -; Features: -; Contact Finish: Tin; Contact Finish Thickness: 35µin (0.90µm); Color: Natural; ComponentLink1URL: https://datasheet.ciiva.com/6813/530470310-sd-6813731.pdf; ComponentLink1Description: https://datasheet.ciiva.com/6813/530470310-sd-6813731.pdf; ComponentLink2URL: https://datasheet.ciiva.com/3935/92660530470310-pcb-headers-3935129.pdf; ComponentLink2Description: https://datasheet.ciiva.com/3935/92660530470310-pcb-headers-3935129.pdf; ComponentLink3URL: https://datasheet.ciiva.com/3117/0530470310-pcb-headers-3117581.pdf; ComponentLink3Description: https://datasheet.ciiva.com/3117/0530470310-pcb-headers-3117581.pdf; Supplier Part Number 1: WM1732-ND
Q1 = DMG3415U-7: MOSFET P-CH 20V 4A SOT-23; Manufacturer: Diodes; Channel Type: P-Channel; Drain-Source On Resistance-Max: 39 mO; Qg Gate Charge: 9.1 nC; Rated Power Dissipation: 900 mW; Supplier 1: Digi-Key; Manufacturer Part Number: DMG3415U-7; Stock 1: 2010; Pricing 1: 1=0.54, 10=0.38, 100=0.2493, 500=0.1473, 1000=0.1133 (USD); Drain-to-Source Voltage [Vdss]: 20 V; ComponentLink1URL: https://datasheet.ciiva.com/11174/ds31735-11174977.pdf; ComponentLink1Description: https://datasheet.ciiva.com/11174/ds31735-11174977.pdf; ComponentLink2URL: https://datasheet.ciiva.com/935/ds31735-935013.pdf; ComponentLink2Description: https://datasheet.ciiva.com/935/ds31735-935013.pdf; ComponentLink3URL: https://datasheet.ciiva.com/935/ds31735-935014.pdf; ComponentLink3Description: https://datasheet.ciiva.com/935/ds31735-935014.pdf; ComponentLink4URL: https://datasheet.ciiva.com/935/ds31735-935015.pdf; ComponentLink4Description: https://datasheet.ciiva.com/935/ds31735-935015.pdf; ComponentLink5URL: https://datasheet.ciiva.com/13061/ds31735-64958-13061831.pdf; ComponentLink5Description: https://datasheet.ciiva.com/13061/ds31735-64958-13061831.pdf; ComponentLink6URL: https://datasheet.ciiva.com/22712/1915618-22712394.pdf; ComponentLink6Description: https://datasheet.ciiva.com/22712/1915618-22712394.pdf; ComponentLink7URL: https://datasheet.ciiva.com/8023/ds31735-8023980.pdf; ComponentLink7Description: https://datasheet.ciiva.com/8023/ds31735-8023980.pdf; ComponentLink8URL: https://datasheet.ciiva.com/8115/ds31735-8115357.pdf; ComponentLink8Description: https://datasheet.ciiva.com/8115/ds31735-8115357.pdf; ComponentLink9URL: https://datasheet.ciiva.com/16387/ds31735-16387485.pdf; ComponentLink9Description: https://datasheet.ciiva.com/16387/ds31735-16387485.pdf; Supplier Part Number 1: DMG3415UDICT-ND
R1 R2 R7 R8 R11 R14 R15 = RC0805FR-0710KL: RES SMD 10K OHM 1% 1/8W 0805; Manufacturer: Yageo; Power Rating: 125 mW (1/8 W); Voltage Rating: 150 V; Temperature Coefficient: 100 PPM / C; Supplier 1: Digi-Key; Manufacturer Part Number: RC0805FR-0710KL; Stock 1: 19355771; Pricing 1: 1=0.1, 10=0.022, 100=0.0088, 1000=0.004, 2500=0.0034 (USD); Termination Style: SMD/SMT; Product: Thick Film Resistors General Purpose; Tolerance: 1 %; Case Code - in: 0805; Case Code - mm: 2012; Series: RC; Operating Temperature Range: - 55 C to + 155 C; Packaging: Reel; ComponentLink1URL: https://datasheet.ciiva.com/11808/0900766b8106beab-11808151.pdf; ComponentLink1Description: https://datasheet.ciiva.com/11808/0900766b8106beab-11808151.pdf; ComponentLink2URL: https://datasheet.ciiva.com/12669/rc0805-12669688.pdf; ComponentLink2Description: https://datasheet.ciiva.com/12669/rc0805-12669688.pdf; ComponentLink3URL: https://datasheet.ciiva.com/46447/444164-46447563.pdf; ComponentLink3Description: https://datasheet.ciiva.com/46447/444164-46447563.pdf; ComponentLink4URL: https://datasheet.ciiva.com/2456/pyu-r-int-thick-7-2456972.pdf; ComponentLink4Description: https://datasheet.ciiva.com/2456/pyu-r-int-thick-7-2456972.pdf; ComponentLink5URL: https://datasheet.ciiva.com/2456/pyu-r-int-thick-7-2456973.pdf; ComponentLink5Description: https://datasheet.ciiva.com/2456/pyu-r-int-thick-7-2456973.pdf; ComponentLink6URL: https://datasheet.ciiva.com/2456/pyu-r-int-thick-7-2456974.pdf; ComponentLink6Description: https://datasheet.ciiva.com/2456/pyu-r-int-thick-7-2456974.pdf; ComponentLink7URL: https://datasheet.ciiva.com/16747/rc0805-16747087.pdf; ComponentLink7Description: https://datasheet.ciiva.com/16747/rc0805-16747087.pdf; Supplier Part Number 1: 311-10.0KCRCT-ND
R3 R13 R16-R18 = RNCP0805FTD1K00: RNCP 0805 0.25W 1kO ±1% ±100ppm/°C High Power Anti-Sulfur ThinFilm Chip Resistor; Manufacturer: Stackpole Electronics; Power (Watts): 0.25W, 1/4W; Supplier 1: Digi-Key; Manufacturer Part Number: RNCP0805FTD1K00; Stock 1: 95093; Pricing 1: 1=0.1, 10=0.037, 100=0.015, 1000=0.0067, 2500=0.0058 (USD); Category: Resistors; Family: Chip Resistor - Surface Mount; Series: RNCP; Packaging: Tape & Reel (TR); Tolerance: ±1%; Composition: Thin Film; Features: Anti-Sulfur, Moisture Resistant; Temperature Coefficient: ±100ppm/°C; Operating Temperature: -55°C ~ 155°C; Package / Case: 0805 (2012 Metric); Supplier Device Package: 0805; Size / Dimension: 0.079" L x 0.049" W (2.00mm x 1.25mm); Height: 0.024" (0.60mm); Number of Terminations: 2; ComponentLink1URL: http://www.seielect.com/Catalog/SEI-rncp.pdf; ComponentLink1Description: http://www.seielect.com/Catalog/SEI-rncp.pdf; Supplier Part Number 1: RNCP0805FTD1K00CT-ND
R4-R6 R10 R20-R22 R30-R41 = RR1220P-103-D: RES SMD 10K OHM 0.5% 1/10W 0805; Manufacturer: Susumu; Power Rating: 100 mW; Temperature Coefficient: 25 PPM / C; Voltage Rating: 100 V; Unit Weight: 0.000194 oz; Supplier 1: Digi-Key; Manufacturer Part Number: RR1220P-103-D; Stock 1: 841412; Pricing 1: 1=0.11, 10=0.098, 100=0.0376, 1000=0.0165, 2500=0.0143 (USD); Product Category: Thin Film Resistors; RoHS: True; Tolerance: 0.5 %; Case Code - in: 0805; Case Code - mm: 2012; Operating Temperature Range: - 55 C to + 125 C; Packaging: Reel; Brand: Susumu; Height: 0.4 mm; Length: 2 mm; Package / Case: 0805 (2012 metric); Product: Thin Film Resistors SMD; Termination Style: SMD/SMT; Width: 1.25 mm; ComponentLink1URL: https://datasheet.ciiva.com/2487/rr-data-sheet-2487031.pdf; ComponentLink1Description: https://datasheet.ciiva.com/2487/rr-data-sheet-2487031.pdf; ComponentLink2URL: https://datasheet.ciiva.com/2487/rr-data-sheet-2487032.pdf; ComponentLink2Description: https://datasheet.ciiva.com/2487/rr-data-sheet-2487032.pdf; ComponentLink3URL: https://datasheet.ciiva.com/11820/0900766b80808d64-11820664.pdf; ComponentLink3Description: https://datasheet.ciiva.com/11820/0900766b80808d64-11820664.pdf; ComponentLink4URL: https://datasheet.ciiva.com/2487/rr-data-sheet-2487033.pdf; ComponentLink4Description: https://datasheet.ciiva.com/2487/rr-data-sheet-2487033.pdf; ComponentLink5URL: https://datasheet.ciiva.com/7984/1581132-7984412.pdf; ComponentLink5Description: https://datasheet.ciiva.com/7984/1581132-7984412.pdf; Supplier Part Number 1: RR12P10.0KDCT-ND
R9 R12 R23 = RPC0805JT100K: RES SMD 100K OHM 5% 1/4W 0805; Manufacturer: Stackpole Electronics; Unit PriceUSD: RPC; Product Training Modules: Pulse Handling Resistor Solutions; Power (Watts): 0.25W, 1/4W; Temperature Coefficient: ±100ppm/°C; Supplier 1: Digi-Key; Manufacturer Part Number: RPC0805JT100K; Stock 1: 10226; Pricing 1: 1=0.2, 10=0.173, 100=0.0676, 1000=0.0283, 2500=0.026 (USD); Quantity Available: Tape & Reel (TR); Minimum Quantity: 100k; RoHS Information: RoHS Compliance; Standard Package: 5,000; Category: Resistors; Family: Chip Resistor - Surface Mount; Series: RPC; Packaging: Tape & Reel (TR); Tolerance: ±5%; Composition: Thick Film; Features: Pulse Withstanding; Operating Temperature: -55°C ~ 155°C; Package / Case: 0805 (2012 Metric); Supplier Device Package: 0805; Size / Dimension: 0.079" L x 0.049" W (2.00mm x 1.25mm); Height: 0.028" (0.70mm); Number of Terminations: 2; ComponentLink1URL: https://www.seielect.com/Catalog/SEI-rpc.pdf; ComponentLink1Description: https://www.seielect.com/Catalog/SEI-rpc.pdf; ComponentLink2URL: http://www.seielect.com/Catalog/SEI-RPC.pdf; ComponentLink2Description: http://www.seielect.com/Catalog/SEI-RPC.pdf; Supplier Part Number 1: RPC0805JT100KCT-ND
R19 = RC0805FR-0710ML: YAGEO (PHYCOMP)         RC0805FR-0710ML             SMD Chip Resistor, Thick Film, 10 Mohm, 150 V, 0805 [2012 Metric], 250 mW,  1%, RC Series; Power Rating: 125 mW (1/8 W); Voltage Rating: 150 V; Temperature Coefficient: 100 PPM / C; Supplier 1: Digi-Key; Manufacturer: Yageo; Manufacturer Part Number: RC0805FR-0710ML; Stock 1: 689794; Pricing 1: 1=0.1, 10=0.023, 100=0.0095, 1000=0.0043, 2500=0.0037 (USD); Termination Style: SMD/SMT; Product: Thick Film Resistors General Purpose; Tolerance: 1 %; Case Code - in: 0805; Case Code - mm: 2012; Series: RC; Operating Temperature Range: - 55 C to + 155 C; Packaging: Reel; ComponentLink1URL: https://datasheet.ciiva.com/11819/0900766b8106beab-11819794.pdf; ComponentLink1Description: https://datasheet.ciiva.com/11819/0900766b8106beab-11819794.pdf; ComponentLink2URL: https://datasheet.ciiva.com/7941/444164-7941685.pdf; ComponentLink2Description: https://datasheet.ciiva.com/7941/444164-7941685.pdf; ComponentLink3URL: https://datasheet.ciiva.com/7941/444164-7941686.pdf; ComponentLink3Description: https://datasheet.ciiva.com/7941/444164-7941686.pdf; ComponentLink4URL: https://datasheet.ciiva.com/46447/444164-46447564.pdf; ComponentLink4Description: https://datasheet.ciiva.com/46447/444164-46447564.pdf; ComponentLink5URL: https://datasheet.ciiva.com/12667/rc0805-12667934.pdf; ComponentLink5Description: https://datasheet.ciiva.com/12667/rc0805-12667934.pdf; ComponentLink6URL: https://datasheet.ciiva.com/16741/rc0805-16741023.pdf; ComponentLink6Description: https://datasheet.ciiva.com/16741/rc0805-16741023.pdf; Supplier Part Number 1: 311-10.0MCRCT-ND
R24-R29 R42-R47 = ERA6AEB5902V: RES SMD 59K OHM 0.1% 1/8W 0805; Manufacturer: Panasonic; Power Rating: 125mW; Voltage Rating: 100V; Temperature Coefficient: 25ppm/°C; Supplier 1: Digi-Key; Manufacturer Part Number: ERA6AEB5902V; Stock 1: 12781; Pricing 1: 1=0.36, 10=0.302, 100=0.1182, 1000=0.04948, 2500=0.04536 (USD); Mount: Surface Mount; Case/Package: 0805; Number of Pins: 2; Case Code (Metric): 2012; Case Code (Imperial): 0805; Contact Plating: Tin; Min Operating Temperature: -55°C; Max Operating Temperature: 155°C; Tolerance: 0.1%; Packaging: Tape and Reel; Package Quantity: 1; Composition: Metal Film,Thin Film; Number of Terminations: 2; Termination: Solder; Military Standard: Not; Max Power Dissipation: 125mW; Voltage Rating (DC): 100V; Features: Automotive AEC-Q200; Length: 2mm; Height: 0.5mm; Width: 1.25mm; Depth: 1.25mm; Radiation Hardening: No; Lead Free: Lead Free; ComponentLink1URL: http://industrial.panasonic.com/www-data/pdf/AOA0000/AOA0000CE26.pdf?src-supplier=Avnet; ComponentLink1Description: http://industrial.panasonic.com/www-data/pdf/AOA0000/AOA0000CE26.pdf?src-supplier=Avnet; ComponentLink2URL: http://www.farnell.com/datasheets/485442.pdf?src-supplier=Farnell; ComponentLink2Description: http://www.farnell.com/datasheets/485442.pdf?src-supplier=Farnell; ComponentLink3URL: http://industrial.panasonic.com/www-data/pdf/AOA0000/AOA0000CE26.pdf?src-supplier=Avnet+Europe; ComponentLink3Description: http://industrial.panasonic.com/www-data/pdf/AOA0000/AOA0000CE26.pdf?src-supplier=Avnet+Europe; ComponentLink4URL: http://uk.rs-online.com/webdocs/0eb1/0900766b80eb1d8c.pdf?src-supplier=RSComponents; ComponentLink4Description: http://uk.rs-online.com/webdocs/0eb1/0900766b80eb1d8c.pdf?src-supplier=RSComponents; ComponentLink5URL: http://www.produktinfo.conrad.com/datenblaetter/1100000-1199999/001181336-da-01-en-WIDERSTAND_ERA_0805_59K0_0_1__5000ST.pdf?src-supplier=Conrad; ComponentLink5Description: http://www.produktinfo.conrad.com/datenblaetter/1100000-1199999/001181336-da-01-en-WIDERSTAND_ERA_0805_59K0_0_1__5000ST.pdf?src-supplier=Conrad; Supplier Part Number 1: P59KDACT-ND
S1 = KMR631NGULCLFS: SWITCH TACTILE SPST-NO 50MA 32V; Manufacturer: ITT C&K; Mechanical Life: 150000Cycles; Illumination Type: Non-Illuminated; Operating Force: 300gf; Throw Configuration: SPST; Switch Function: Off-Mom; Actuator Type: Standard; Ratings: Dust Tight,IP67,Waterproof; Supplier 1: Digi-Key; Manufacturer Part Number: KMR631NGULCLFS; Stock 1: 0; Mount: Surface Mount; Min Operating Temperature: -40°C; Max Operating Temperature: 85°C; Packaging: Tape and Reel; Termination: Gull Wing; Supplier Part Number 1: CKN10685DKR-ND
TP1-TP9 = Testpoint
U1 = 2472: A 9-DOF A O IMU F B - BNO055; Manufacturer: Adafruit Industries; Sensor Type: Accelerometer, Gyroscope, Magnetometer, 3 Axis; Embedded: Yes, MCU, 32-Bit; Supplied Contents: Board; Supplier 1: Digi-Key; Manufacturer Part Number: 2472; Stock 1: 281; Pricing 1: 1=34.95 (USD); Category: Programmers, Development Systems; Family: Evaluation Boards - Sensors; Series: -; Sensing Range: -; Interface: -; Sensitivity: -; Voltage - Supply: -; Utilized IC / Part: BNO055; ComponentLink1URL: https://learn.adafruit.com/downloads/pdf/adafruit-bno055-absolute-orientation-sensor.pdf; ComponentLink1Description: https://learn.adafruit.com/downloads/pdf/adafruit-bno055-absolute-orientation-sensor.pdf; Supplier Part Number 1: 1528-1426-ND
U2 = TMP100AQDBVRQ1: SENSOR DIGITAL -55C-125C SOT23-6; Manufacturer: Texas Instruments; Interface: 2-Wire,I2C,SMBus; Supplier 1: Digi-Key; Manufacturer Part Number: TMP100AQDBVRQ1; Stock 1: 2243; Pricing 1: 1=2.08, 10=1.872, 100=1.505, 500=1.23652, 1000=1.02454 (USD); Min Operating Temperature: -40°C; Max Operating Temperature: 125°C; Supplier Part Number 1: 296-48716-6-ND
U3 = MCP73831T-2ATI/OT: MICROCHIP         MCP73831T-2ATI/OT             Single Cell Li Ion/Li Polymer Charge Management Controller in SOT-23-5 Package; Battery Type: Lithium-Ion, Lithium-Polymer; Typical Operating Supply Voltage: 3.75 → 6 V; Maximum Output Current: 500mA; Maximum Output Voltage: 4.232 V; Minimum Output Current: 15mA; Minimum Output Voltage: 4.168 V; Supplier 1: Digi-Key; Manufacturer: Microchip; Manufacturer Part Number: MCP73831T-2ATI/OT; Stock 1: 3788; Pricing 1: 1=0.59, 25=0.4984, 100=0.4452 (USD); Mounting Type: Surface Mount; Package Type: SOT-23; Pin Count: 5; Dimensions: 3.1 x 1.8 x 1.3mm; Length: 3.1mm; Maximum Operating Temperature: +85 °C; Height: 1.3mm; Width: 1.8mm; Minimum Operating Temperature: -40 °C; ComponentLink1URL: https://datasheet.ciiva.com/1931/21984e-1931956.pdf; ComponentLink1Description: https://datasheet.ciiva.com/1931/21984e-1931956.pdf; ComponentLink2URL: https://datasheet.ciiva.com/1931/21984e-1931957.pdf; ComponentLink2Description: https://datasheet.ciiva.com/1931/21984e-1931957.pdf; ComponentLink3URL: https://datasheet.ciiva.com/1931/21984e-1931958.pdf; ComponentLink3Description: https://datasheet.ciiva.com/1931/21984e-1931958.pdf; ComponentLink4URL: https://datasheet.ciiva.com/17299/21984e-17299304.pdf; ComponentLink4Description: https://datasheet.ciiva.com/17299/21984e-17299304.pdf; ComponentLink5URL: https://datasheet.ciiva.com/1137/630369-1137804.pdf; ComponentLink5Description: https://datasheet.ciiva.com/1137/630369-1137804.pdf; ComponentLink6URL: https://datasheet.ciiva.com/8039/630369-8039388.pdf; ComponentLink6Description: https://datasheet.ciiva.com/8039/630369-8039388.pdf; ComponentLink7URL: https://datasheet.ciiva.com/16217/filehandler-aspxddocname-en025112-16217052.pdf; ComponentLink7Description: https://datasheet.ciiva.com/16217/filehandler-aspxddocname-en025112-16217052.pdf; ComponentLink8URL: https://datasheet.ciiva.com/3213/21984e-3213405.pdf; ComponentLink8Description: https://datasheet.ciiva.com/3213/21984e-3213405.pdf; ComponentLink9URL: https://datasheet.ciiva.com/26344/651522-da-01-en-contr-mcp73831t-2ati-ot-sot-23-5-mcp-26344457.pdf; ComponentLink9Description: https://datasheet.ciiva.com/26344/651522-da-01-en-contr-mcp73831t-2ati-ot-sot-23-5-mcp-26344457.pdf; Supplier Part Number 1: MCP73831T-2ATI/OTCT-ND